# Altium project driver_1.PrjPcb
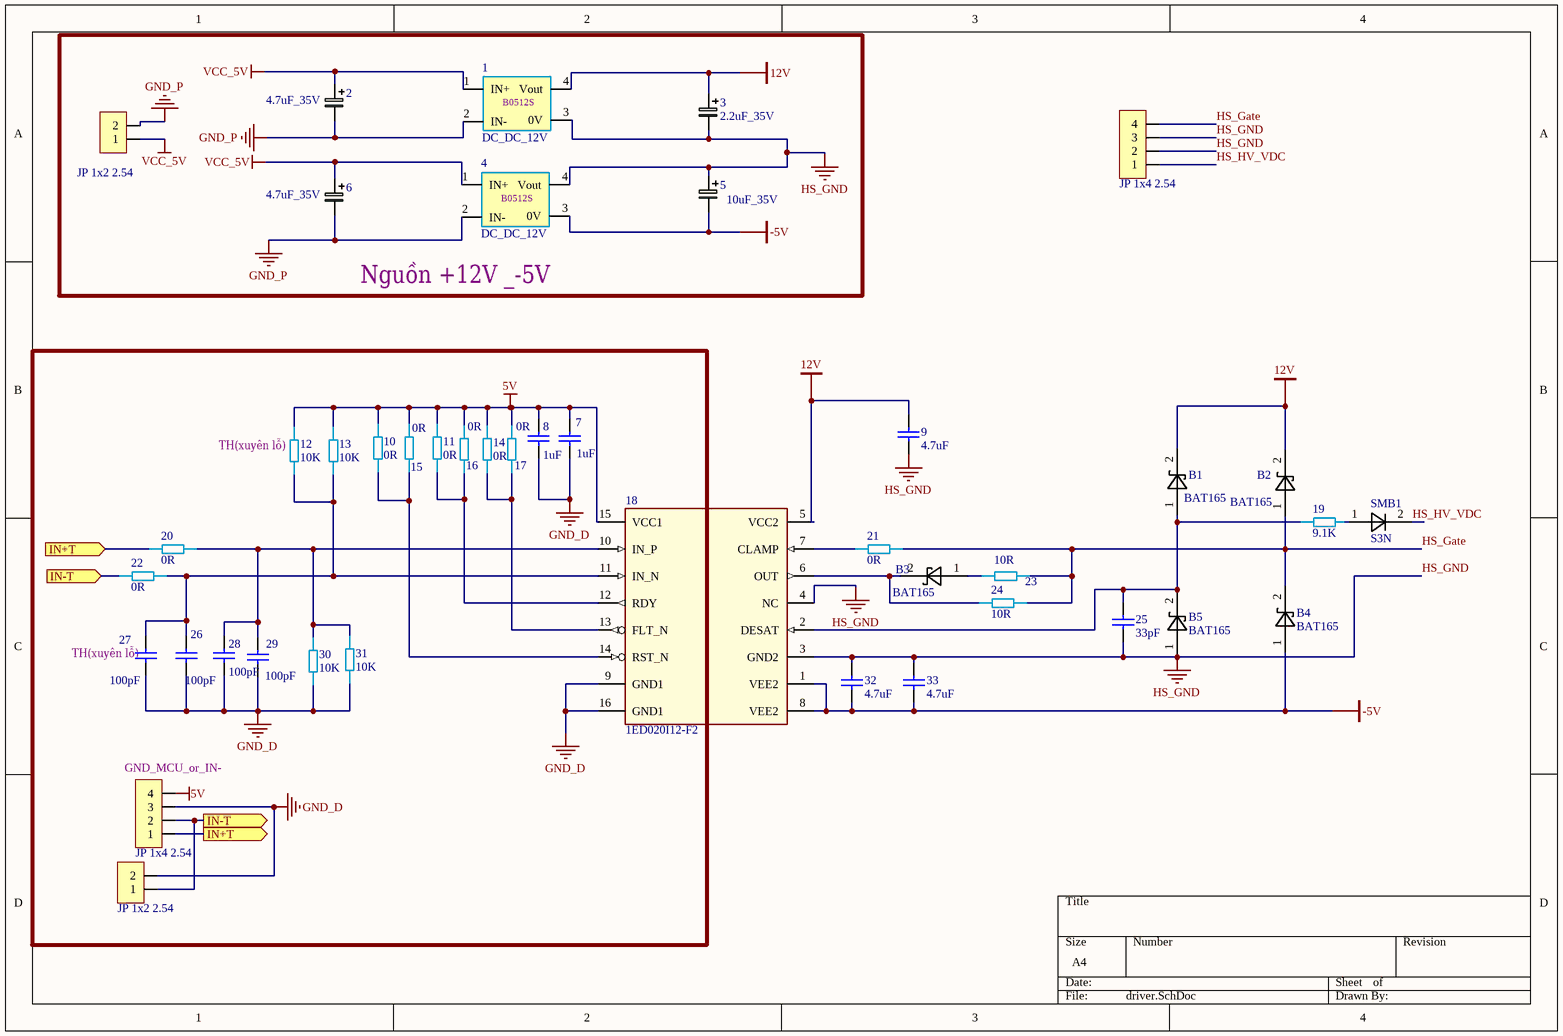
[diagram p0: driver.SchDoc]
1 sheet, 43 parts. Net scope: flat (ports and power ports of the same name join across sheets).
Board file: driver_V1.PcbDoc

## Sheet driver.SchDoc
size A4

### Parts
1  DC_DC_12V  [B0512S/D-1W]
2  4.7uF_35V  [tu_4x5.4mm]
3  2.2uF_35V  [tu_4x5.4mm]
4  DC_DC_12V  [B0512S/D-1W]
5  10uF_35V  [tu_4x5.4mm]
6  4.7uF_35V  [tu_4x5.4mm]
7  1uF  [Tu 0805_N]
8  value 1uF  [CAPR5.08-4x2.5]
9  4.7uF  [tu 1206_N]
10  0R  [RES_Dung]
11  0R  [RES_Dung]
12  10K  [RES_Dung]
13  10K  [RES1206]
14  0R  [RES_Dung]
15  0R  [RES1206]
16  0R  [RES1206]
17  0R  [RES1206]
18  1ED020I12-F2  [SOIC127P1028X264-16N-1]
19  9.1K  [RES_2512]
20  0R  [RES1206]
21  0R  [RES_2512]
22  0R  [RES1206]
23  10R  [RES_2512]
24  10R  [RES_2512]
25  33pF  [Tu 0805_N]
26  100pF  [Tu 0603]
27  value 100pF  [CAPR5.08-4x2.5]
28  value 100pF  [CAPR5.08-4x2.5]
29  100pF  [Tu 0603]
30  10K  [RES1206]
31  10K  [RES_Dung]
32  4.7uF  [tu 1206_N]
33  4.7uF  [tu 1206_N]
34  JP 1x2 2.54  [JP 1x2 DT_n]
B1  BAT165  [BAT165E6327HTSA1TRND]
B2  BAT165  [BAT165E6327HTSA1TRND]
B3  BAT165  [BAT165E6327HTSA1TRND]
B4  BAT165  [BAT165E6327HTSA1TRND]
B5  BAT165  [BAT165E6327HTSA1TRND]
HS_GATE1  JP 1x4 2.54  [JP 1X4 DT_N]
IN+1  JP 1x4 2.54  [JP 1X4 DT_N]
JP1  JP 1x2 2.54  [JP 1x2 DT_n]
SMB1  S3N  [SMB]

### Blocks framed on the sheet
Nguồn +12V _-5V: 1-6 JP1

### Ports
IN+T (in), IN+T (out), IN-T (in), IN-T (out)

### Nets
5V: 7.2 8.2 10.2 11.2 12.2 13.2 14.2 15.2 16.1 17.2 18.15(VCC1) IN+1.4
12V: 1.4(Vout) 3.1 9.2 18.5(VCC2) B1.2 B2.2
-5V: 4.3(0V) 5.2 18.1(VEE2) 18.8(VEE2) 32.1 33.1 B4.1
GND_D: 7.1 8.1 18.9(GND1) 18.16(GND1) 26.1 27.1 28.1 29.1 30.1 31.1 34.2 IN+1.3
GND_P: 1.2(IN-) 2.2 4.2(IN-) 6.2 JP1.2
HS_GND: 1.3(0V) 3.2 4.4(Vout) 5.1 9.1 18.3(GND2) 18.4(NC) 25.1 32.2 33.2 B5.1 HS_GATE1.2 HS_GATE1.3
VCC_5V: 1.1(IN+) 2.1 4.1(IN+) 6.1 JP1.1
HS_Gate: 21.2 23.2 24.2 B2.1 B4.2 HS_GATE1.4
HS_HV_VDC: HS_GATE1.1 SMB1.2
Net10_1: 10.1 15.1 18.14(RST_N)
Net11_1: 11.1 16.2 18.12(RDY)
Net12_1: 12.1 13.1 18.11(IN_N) 22.2 26.2 27.2
Net14_1: 14.1 17.1 18.13(FLT_N)
Net18_2: 18.2(DESAT) 19.1 25.2 B1.1 B5.2
Net18_6: 18.6(OUT) 24.1 B3.2
Net18_7: 18.7(CLAMP) 21.1
Net18_10: 18.10(IN_P) 20.2 28.2 29.2 30.2 31.2
Net19_2: 19.2 SMB1.1
Net20_1: 20.1 IN+1.1 ; port IN+T
Net22_1: 22.1 34.1 IN+1.2 ; port IN-T
Net23_1: 23.1 B3.1

### Notes on the sheet
- (near 12) TH(xuyên lỗ)
- (near 27) TH(xuyên lỗ)
- (near IN+1) GND_MCU_or_IN-
- (in symbol DC_DC_12v) B0512S

### Library data of the parts
2 3 5 6 = capacitor_electric
7 25 = cap_0805
8 27 28 = Cap_gom: Capacitor; Published: 8-Jun-2000; LatestRevisionDate: 17-Jul-2002; LatestRevisionNote: Re-released for DXP Platform.; PackageReference: RAD-0.3; Publisher: Altium Limited
9 32 33 = cap_1210
10-17 19-24 30 31 = 311-0.0GRTR-ND
18 = 1ED020I12-F2: Single IGBT Driver IC; Manufacturer: Infineon Technologies; Manufacturer Order Number: 1ED020I12-F2; PackageReference: PG-DSO-16-15
26 29 = cap_0603
34 JP1 = JP 1x2 2.54 Duc Thang: Cắm; Ten_Linh_Kien: Jump Đơn Đực 2.54MM 1x40P Thẳng 11MM; Don_Vi: Con; Ma_Hang: MH000903; Ghi_Chu: *; Kieu_Chan: *; Chung_Loai: Cắm
HS_GATE1 IN+1 = JP 1x4 2.54 Duc Thang: Cắm; Ten_Linh_Kien: Jump Đơn Đực 2.54MM 1x40P Thẳng 11MM; Don_Vi: Con; Ma_Hang: MH000903; Ghi_Chu: *; Kieu_Chan: *; Chung_Loai: Cắm
SMB1 = S3A-S3N